# Altium schematic sheet valve.SchDoc
size A
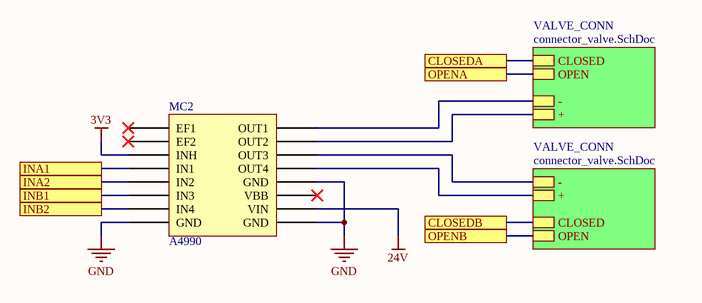
[diagram p0: valve.SchDoc]

## Parts
MC2  A4990  [A4990 Dual Motor Driver Carrier]

## Sub-sheets
VALVE_CONN = connector_valve.SchDoc: CLOSED, OPEN, -, +
VALVE_CONN = connector_valve.SchDoc: CLOSED, OPEN, -, +

## Ports
CLOSEDA, CLOSEDB, INA1, INA2, INB1, INB2, OPENA, OPENB

## Nets
3V3: MC2.3(INH)
24V: MC2.10(VIN)
GND: MC2.8(GND) MC2.9(GND) MC2.12(GND)
CLOSEDA: port CLOSEDA, sheet VALVE_CONN/CLOSED
CLOSEDB: port CLOSEDB, sheet VALVE_CONN/CLOSED
INA1: MC2.4(IN1) ; port INA1
INA2: MC2.5(IN2) ; port INA2
INB1: MC2.6(IN3) ; port INB1
INB2: MC2.7(IN4) ; port INB2
OPENA: port OPENA, sheet VALVE_CONN/OPEN
OPENB: port OPENB, sheet VALVE_CONN/OPEN
NetMC2_13: MC2.13(OUT4) ; sheet VALVE_CONN/+
NetMC2_14: MC2.14(OUT3) ; sheet VALVE_CONN/-
NetMC2_15: MC2.15(OUT2) ; sheet VALVE_CONN/+
NetMC2_16: MC2.16(OUT1) ; sheet VALVE_CONN/-

Not connected (* = marked no-connect by the designer): MC2 1(EF1)* 2(EF2)* 11(VBB)*

## Library data of the parts
MC2 = A4990 Dual Motor Driver Carrier